# EAGLE schematic USI-WM-BN-BM-22-v1.0.0 (EAGLE 7.7.0)
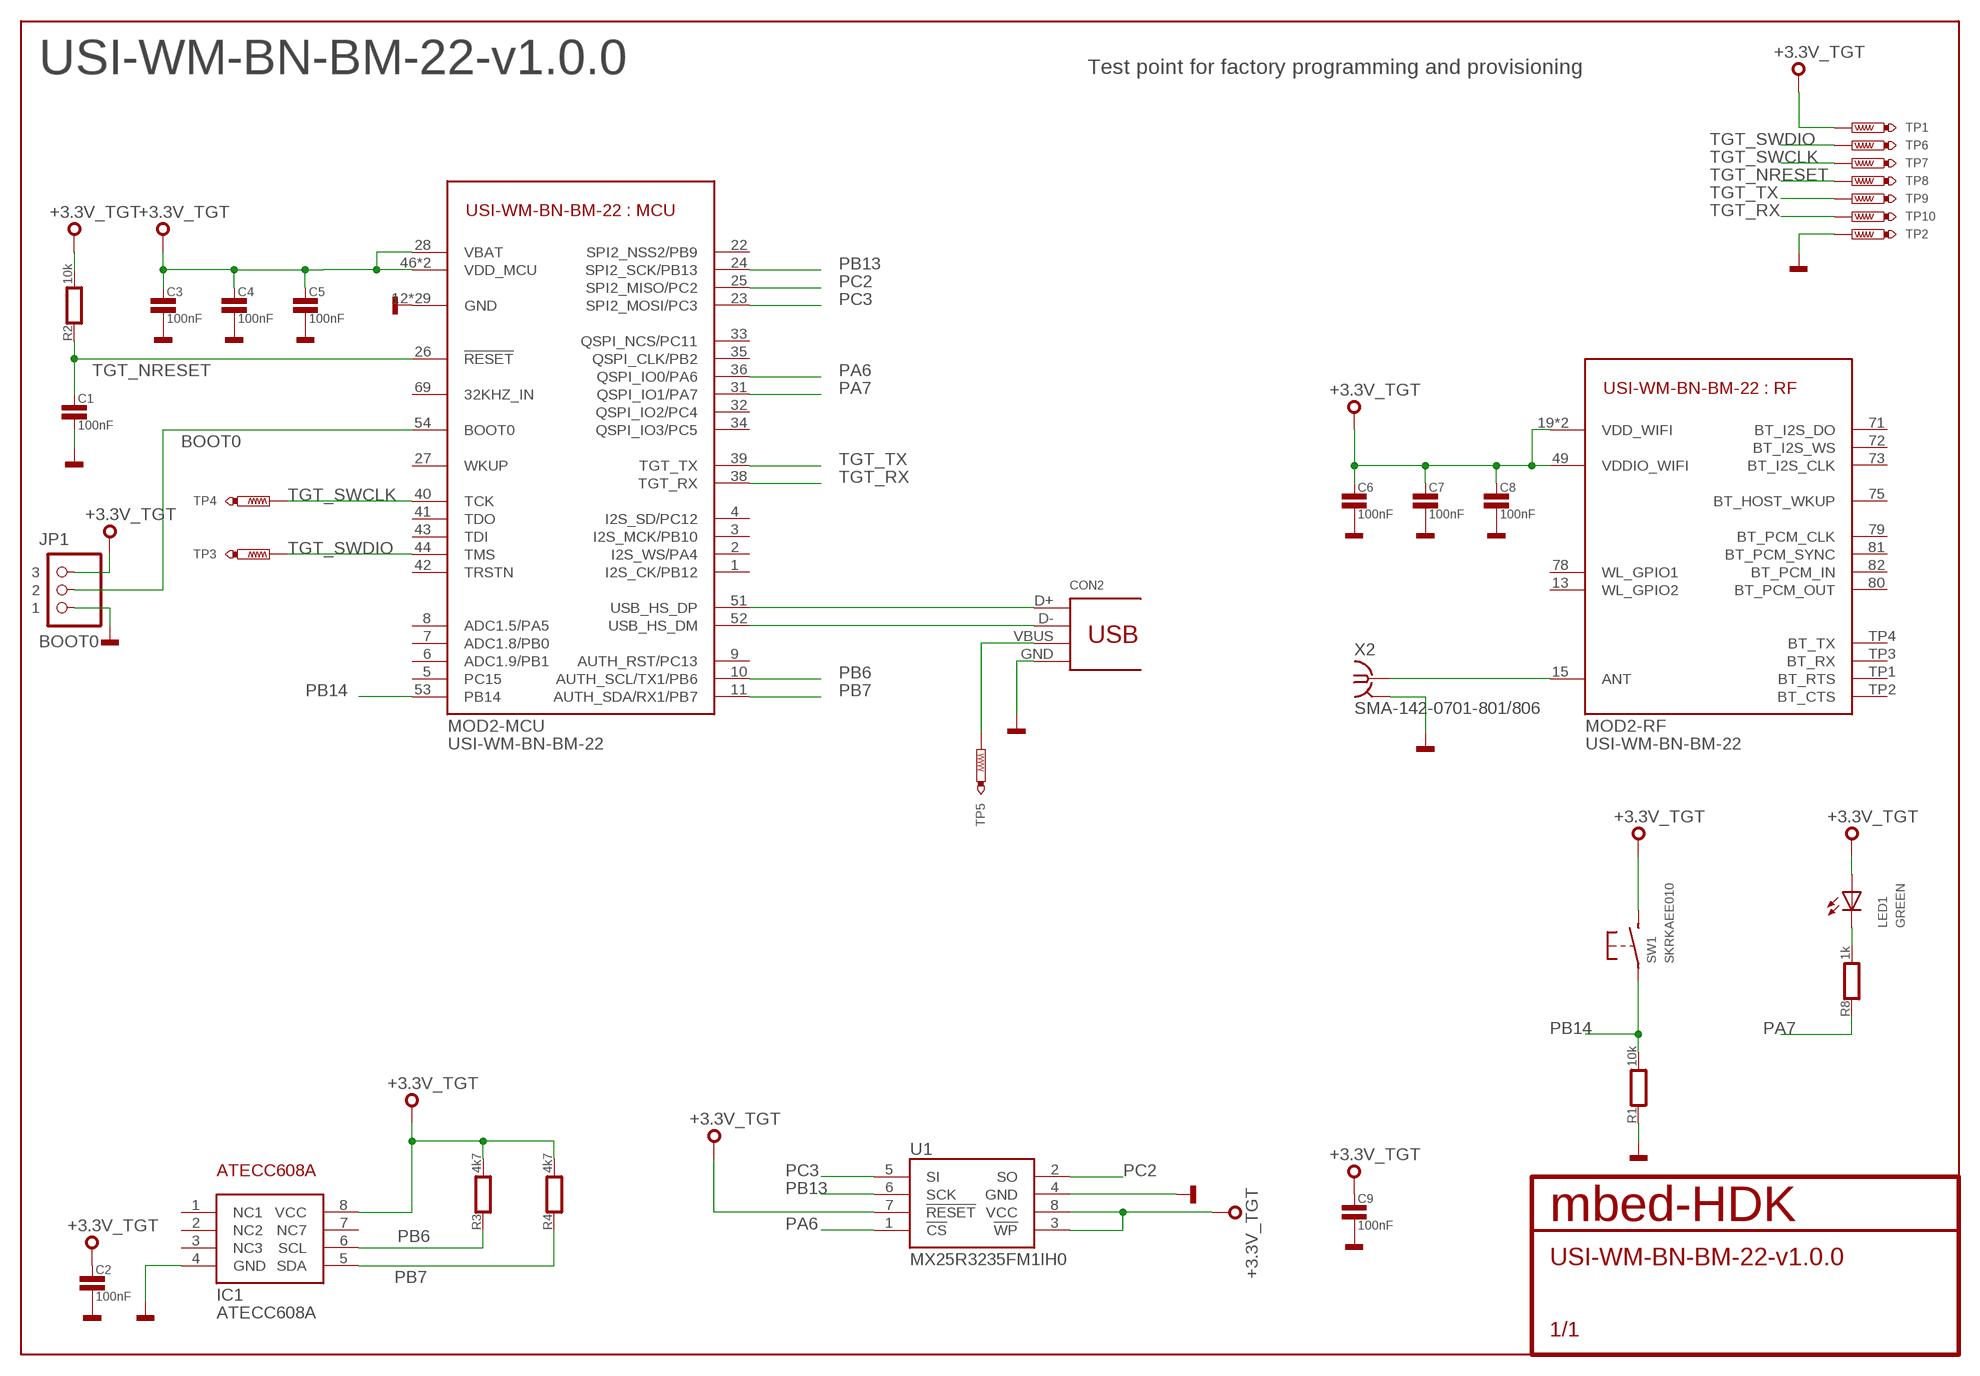
[diagram p0: schematic, sheet 1]

## Parts
C1  100nF  C0603  [0603]
C2  100nF  C0603  [0603]
C3  100nF  C0603  [0603]
C4  100nF  C0603  [0603]
C5  100nF  C0603  [0603]
C6  100nF  C0603  [0603]
C7  100nF  C0603  [0603]
C8  100nF  C0603  [0603]
C9  100nF  C0603  [0603]
CON2  47346-0001  [USB-MICRO-B-H]
IC1  ATECC608A  [SO8]
JP1  BOOT0  PINHD-1X3  [1X03]
LED1  GREEN  SMD_LED0603  [CHIPLED_0603]
MOD2  USI-WM-BN-BM-22  [USI-WM-BN-BM-22]
R1  10k  R0603  [0603]
R2  10k  R0603  [0603]
R3  4k7  R0603  [0603]
R4  4k7  R0603  [0603]
R8  1k  R0603  [0603]
SW1  SKRKAEE010  [SKRKAEE010]
TP1  TEST_POINT-50R-SMD  [TP50-SMD]
TP2  TEST_POINT-50R-SMD  [TP50-SMD]
TP3  TEST_POINT-50R-SMD  [TP50-SMD]
TP4  TEST_POINT-50R-SMD  [TP50-SMD]
TP5  TEST_POINT-50R-SMD  [TP50-SMD]
TP6  TEST_POINT-50R-SMD  [TP50-SMD]
TP7  TEST_POINT-50R-SMD  [TP50-SMD]
TP8  TEST_POINT-50R-SMD  [TP50-SMD]
TP9  TEST_POINT-50R-SMD  [TP50-SMD]
TP10  TEST_POINT-50R-SMD  [TP50-SMD]
U1  MX25R3235FM1IH0  [SO8]
X2  SMA-142-0701-801/806  [J502-ND-142-0701-801/806]

## Nets
+3.3V_TGT: C2.1 C3.1 C4.1 C5.1 C6.1 C7.1 C8.1 C9.1 IC1.8(VCC) JP1.3 LED1.A MOD2.19(-RF:VDD_WIFI) MOD2.20(-RF:VDD_WIFI) MOD2.28(-MCU:VBAT) MOD2.46(-MCU:VDD_MCU) MOD2.47(-MCU:VDD_MCU) MOD2.49(-RF:VDDIO_WIFI) R2.2 R3.2 R4.2 SW1.P$2(S) TP1.TP U1.3(!WP) U1.7(!RESET) U1.8(VCC)
BOOT0: JP1.2 MOD2.54(-MCU:BOOT0)
GND: C1.2 C2.2 C3.2 C4.2 C5.2 C6.2 C7.2 C8.2 C9.2 CON2.GND IC1.4(GND) JP1.1 MOD2.12(-MCU:GND) MOD2.14(-MCU:GND) MOD2.16(-MCU:GND) MOD2.17(-MCU:GND) MOD2.18(-MCU:GND) MOD2.21(-MCU:GND) MOD2.29(-MCU:GND) MOD2.30(-MCU:GND) MOD2.37(-MCU:GND) MOD2.45(-MCU:GND) MOD2.48(-MCU:GND) MOD2.50(-MCU:GND) MOD2.55(-MCU:GND) MOD2.56(-MCU:GND) MOD2.57(-MCU:GND) MOD2.58(-MCU:GND) MOD2.59(-MCU:GND) MOD2.60(-MCU:GND) MOD2.61(-MCU:GND) MOD2.62(-MCU:GND) MOD2.63(-MCU:GND) MOD2.64(-MCU:GND) MOD2.65(-MCU:GND) MOD2.66(-MCU:GND) MOD2.67(-MCU:GND) MOD2.68(-MCU:GND) MOD2.70(-MCU:GND) MOD2.74(-MCU:GND) MOD2.83(-MCU:GND) R1.1 TP2.TP U1.4(GND) X2.G@1 X2.G@2 X2.G@3 X2.G@4
N$2: CON2.D+ MOD2.51(-MCU:USB_HS_DP)
N$3: CON2.D- MOD2.52(-MCU:USB_HS_DM)
N$5: CON2.VBUS TP5.TP
N$6: MOD2.15(-RF:ANT) X2.1
PA6: MOD2.36(-MCU:QSPI_IO0/PA6) U1.1(!CS)
PA7: MOD2.31(-MCU:QSPI_IO1/PA7) R8.1
PA_1: LED1.C R8.2
PB6: IC1.6(SCL) MOD2.10(-MCU:AUTH_SCL/TX1/PB6) R3.1
PB7: IC1.5(SDA) MOD2.11(-MCU:AUTH_SDA/RX1/PB7) R4.1
PB13: MOD2.24(-MCU:SPI2_SCK/PB13) U1.6(SCK)
PB14: MOD2.53(-MCU:PB14) R1.2 SW1.P$1(P)
PC2: MOD2.25(-MCU:SPI2_MISO/PC2) U1.2(SO)
PC3: MOD2.23(-MCU:SPI2_MOSI/PC3) U1.5(SI)
TGT_NRESET: C1.1 MOD2.26(-MCU:!RESET) R2.1 TP8.TP
TGT_RX: MOD2.38(-MCU:TGT_RX) TP10.TP
TGT_SWCLK: MOD2.40(-MCU:TCK) TP4.TP TP7.TP
TGT_SWDIO: MOD2.44(-MCU:TMS) TP3.TP TP6.TP
TGT_TX: MOD2.39(-MCU:TGT_TX) TP9.TP
Unconnected: IC1.1(NC1) IC1.2(NC2) IC1.3(NC3) IC1.7(NC7) MOD2.1(-MCU:I2S_CK/PB12) MOD2.2(-MCU:I2S_WS/PA4) MOD2.3(-MCU:I2S_MCK/PB10) MOD2.4(-MCU:I2S_SD/PC12) MOD2.5(-MCU:PC15) MOD2.6(-MCU:ADC1.9/PB1) MOD2.7(-MCU:ADC1.8/PB0) MOD2.8(-MCU:ADC1.5/PA5) MOD2.9(-MCU:AUTH_RST/PC13) MOD2.13(-RF:WL_GPIO2) MOD2.22(-MCU:SPI2_NSS2/PB9) MOD2.27(-MCU:WKUP) MOD2.32(-MCU:QSPI_IO2/PC4) MOD2.33(-MCU:QSPI_NCS/PC11) MOD2.34(-MCU:QSPI_IO3/PC5) MOD2.35(-MCU:QSPI_CLK/PB2) MOD2.41(-MCU:TDO) MOD2.42(-MCU:TRSTN) MOD2.43(-MCU:TDI) MOD2.69(-MCU:32KHZ_IN) MOD2.71(-RF:BT_I2S_DO) MOD2.72(-RF:BT_I2S_WS) MOD2.73(-RF:BT_I2S_CLK) MOD2.75(-RF:BT_HOST_WKUP) MOD2.78(-RF:WL_GPIO1) MOD2.79(-RF:BT_PCM_CLK) MOD2.80(-RF:BT_PCM_OUT) MOD2.81(-RF:BT_PCM_SYNC) MOD2.82(-RF:BT_PCM_IN) MOD2.TP1(-RF:BT_RTS) MOD2.TP2(-RF:BT_CTS) MOD2.TP3(-RF:BT_RX) MOD2.TP4(-RF:BT_TX)

## Notes on the sheet
- USI-WM-BN-BM-22-v1.0.0 | Test point for factory programming and provisioning

## Library data of the parts
C1-C9 = mbed-HDK-RLC:C: Capacitor
CON2 = mbed-HDK-Connector:47346-0001: USB Receptacle Horizontal Micro Type B; MF: MOLEX; MFN: 47346-0001; OC-MOUSER: 538-47346-0001; OC-NEWARK: 1568026
IC1 = mbed-HDK-MF-ATMEL:ATECC608A: I2C Secure element and crytpo accelerator; MF: Atmel; MFN: ATECC608A; OC-DIGIKEY: ATECC608A-SSHDA-TCT-ND; OC-MOUSER: 556-ATECC608ASSHDAB
JP1 = mbed-HDK-Connector:PINHD-1X3: PIN HEADER
LED1 = mbed-HDK-Optical:SMD_LED: LED SMD, Colour Red; MF: Wurth Electronics Inc; MFN: 150060RS75000; OC-DIGIKEY: 732-4978-1-ND; OC-MOUSER: 710-150060RS75000; OC-NEWARK: 2322071
MOD2 = mbed-HDK-Modules:USI-WM-BN-BM-22
R1-R4 R8 = mbed-HDK-RLC:R: Resistor
SW1 = mbed-HDK-Switch:SKRKAEE010: MOMENTARY SWITCH PUSH VERTICAL (SPST); MF: ALPS; MFN: SKRKAEE010; OC-MOUSER: 688-SKRKAE
TP1-TP10 = mbed-HDK-Connector:TEST_POINT
U1 = mbed-HDK-IC:MX25R3235FM1IH0: Serial Flash 32 Mb 80 Mhz; MF: Macronix; MFN: MX25R3235FM1IH0; OC-DIGIKEY: 1092-1175-ND
X2 = mbed-HDK-Connector:SMA-: SMA 50 Ohm End Launch Jack Receptacle - Round Contact Johnson Components Source: www.johnsoncomponents.com .. J502-ND.pdf; MF: JOHNSON COMPONENTS; MPN: 142-0701-801; OC_FARNELL: 1608592; OC_NEWARK: 90F2624